# Altium schematic sheet TLM_002_MAX6675.SchDoc: =DocumentName
size A4; CompanyName: Scopa Industries LLC; Engineer: Nazar Lysenko / Andrii Antonenko; Organization: Scopa Industries LLC; Address1: Kyiv; Address2: Ukraine; Address3: https://www.scopa.industries/; Address4: oleksyi.y@scopa.industries; SheetNumber: 3; SheetTotal: 11
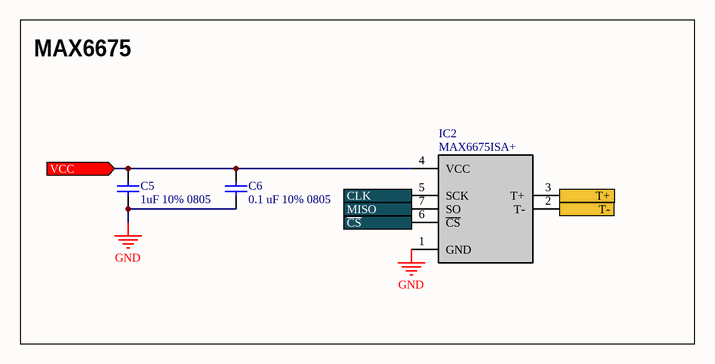
[diagram p0: TLM_002_MAX6675.SchDoc]

## Parts
C5  1uF 10% 0805  [CAPC2013X145X50NL20T20]
C6  0.1 uF 10% 0805  [CAPC2013X140X50ML20T25]
IC2  MAX6675ISA+  [SOIC127P600X175-8N]

## Ports
CLK (in, see TLM_002_MBR[3A], TLM_002_CONNECT[1B], TLM_002_ESP32S3[2B], TLM_002_MAX31856[2B], TLM_002_SD[3B]), MISO (out, see TLM_002_MBR[3A], TLM_002_CONNECT[1A], TLM_002_ESP32S3[3B], TLM_002_MAX31856[2B], TLM_002_SD[3B]), T+ (in, see TLM_002_MBR[3A]), T- (in, see TLM_002_MBR[3A]), VCC (in, see TLM_002_MBR[3A], TLM_002_DS3231SN_RTC[2B], TLM_002_ESP32S3[1A], TLM_002_INA228[1B], TLM_002_LoRa[2B], TLM_002_MAX31856[1B], TLM_002_SD[1B]), ~{CS} (in, see TLM_002_MBR[3A])

## Nets
GND: C5.1 C6.1 IC2.1(GND)
~{CS}: IC2.6(~{CS}) ; port ~{CS}
CLK: IC2.5(SCK) ; port CLK
MISO: IC2.7(SO) ; port MISO
T+: IC2.3(T+) ; port T+
T-: IC2.2(T-) ; port T-
VCC: C5.2 C6.2 IC2.4(VCC) ; port VCC

## Notes on the sheet
- MAX6675
- Title
- Size:
- Date:
- A4
- Author:
- Time:
- Sheet
- Revision:
- of
- File:

## Library data of the parts
C5 = CMP-2007-01676-1: Part Number: VJ0805Y105KXQRW1BC; Manufacturer: Vitramon
C6 = CMP-2007-04651-1: Part Number: 0805DD104KAT2A; Manufacturer: AVX Interconnect / Elco
IC2 = MAX6675ISA+: Integrated Circuit; Manufacturer_Name: Analog Devices; Datasheet Link: http://datasheets.maximintegrated.com/en/ds/MAX6675.pdf; Height: 1.75mm; Manufacturer_Part_Number: MAX6675ISA+; Mouser Part Number: 700-MAX6675ISA; Mouser Price/Stock: https://www.mouser.co.uk/ProductDetail/Analog-Devices-Maxim-Integrated/MAX6675ISA%2b?qs=1THa7WoU59H74vpgspkIMw%3D%3D; Arrow Part Number: MAX6675ISA+; Arrow Price/Stock: https://www.arrow.com/en/products/max6675isa/analog-devices?utm_currency=USD&region=nac